# Altium schematic sheet 89C51最小系统+心形LED.SchDoc
size A4
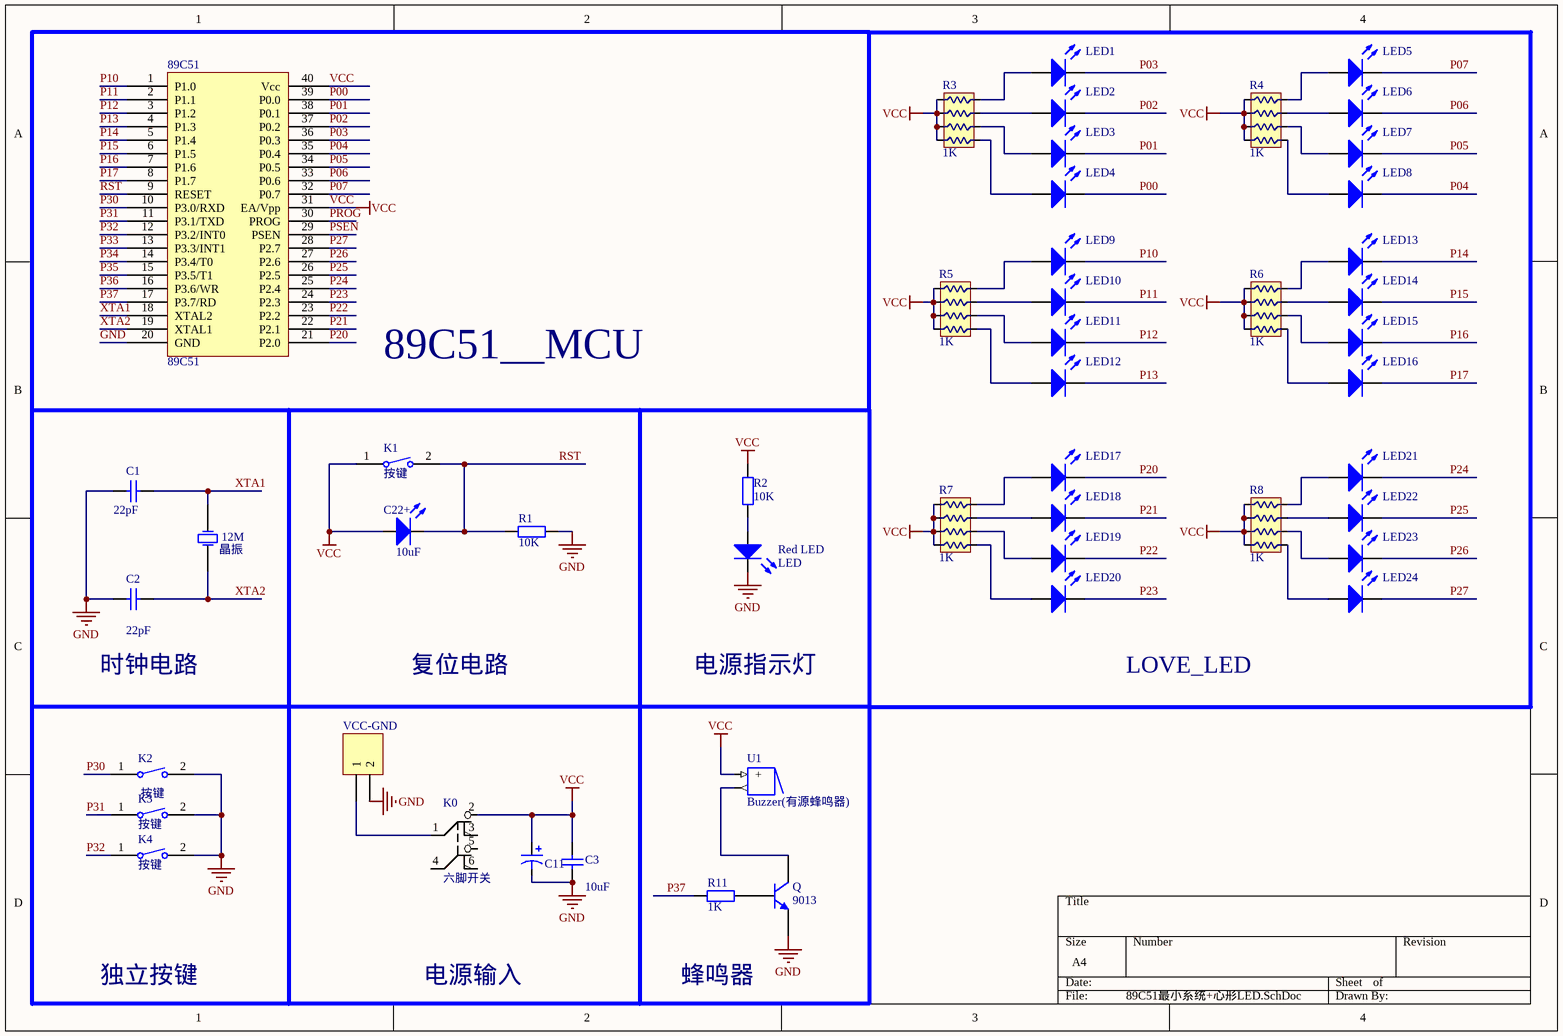
[diagram p0: 89C51最小系统+心形LED.SchDoc]

## Parts
12M  晶振  [晶振]
89C51  89C51  [89C51]
C1  value 22pF  [0805]
C2  value 22pF  [0805]
C3  value 10uF  [0805]
C11  100UF/470UF(封装慎选)  [ED6.3]  (value not drawn)
C22+  10uF  [LED(0805)]
K0  六脚开关  [按钮开关]
K1  按键  [按键]
K2  按键  [按键]
K3  按键  [按键]
K4  按键  [按键]
LED1  (no value)  [LED直插]
LED2  (no value)  [LED直插]
LED3  (no value)  [LED直插]
LED4  (no value)  [LED直插]
LED5  (no value)  [LED直插]
LED6  (no value)  [LED直插]
LED7  (no value)  [LED直插]
LED8  (no value)  [LED直插]
LED9  (no value)  [LED直插]
LED10  (no value)  [LED直插]
LED11  (no value)  [LED直插]
LED12  (no value)  [LED直插]
LED13  (no value)  [LED直插]
LED14  (no value)  [LED直插]
LED15  (no value)  [LED直插]
LED16  (no value)  [LED直插]
LED17  (no value)  [LED直插]
LED18  (no value)  [LED直插]
LED19  (no value)  [LED直插]
LED20  (no value)  [LED直插]
LED21  (no value)  [LED直插]
LED22  (no value)  [LED直插]
LED23  (no value)  [LED直插]
LED24  (no value)  [LED直插]
Q  9013  [TO-226-AA]
R1  10K  [0805]
R2  10K  [0805]
R3  1K  [排阻（4位）]
R4  1K  [排阻（4位）]
R5  1K  [排阻（4位）]
R6  1K  [排阻（4位）]
R7  1K  [排阻（4位）]
R8  1K  [排阻（4位）]
R11  1K  [0805]
Red_LED  LED  [LED(0805)]
U1  Buzzer(有源蜂鸣器)  [Buzzer]
VCC-GND  (no value)  [HDR1X2]

## Nets
GND: 89C51.20(GND) C1.1 C2.1 C3.1 C11.2 K2.2 K3.2 K4.2 Q.3(E) R1.2 Red_LED.2(K) VCC-GND.2
VCC: 89C51.31(EA/Vpp) 89C51.40(Vcc) C3.2 C11.1 C22+.1(A) K0.2 K1.1 R2.2 R3.1 R3.3 R3.5 R3.7 R4.1 R4.3 R4.5 R4.7 R5.1 R5.3 R5.5 R5.7 R6.1 R6.3 R6.5 R6.7 R7.1 R7.3 R7.5 R7.7 R8.1 R8.3 R8.5 R8.7 U1.1(+)
P00: 89C51.39(P0.0) LED4.2(K)
P01: 89C51.38(P0.1) LED3.2(K)
P02: 89C51.37(P0.2) LED2.2(K)
P03: 89C51.36(P0.3) LED1.2(K)
P04: 89C51.35(P0.4) LED8.2(K)
P05: 89C51.34(P0.5) LED7.2(K)
P06: 89C51.33(P0.6) LED6.2(K)
P07: 89C51.32(P0.7) LED5.2(K)
P10: 89C51.1(P1.0) LED9.2(K)
P11: 89C51.2(P1.1) LED10.2(K)
P12: 89C51.3(P1.2) LED11.2(K)
P13: 89C51.4(P1.3) LED12.2(K)
P14: 89C51.5(P1.4) LED13.2(K)
P15: 89C51.6(P1.5) LED14.2(K)
P16: 89C51.7(P1.6) LED15.2(K)
P17: 89C51.8(P1.7) LED16.2(K)
P20: 89C51.21(P2.0) LED17.2(K)
P21: 89C51.22(P2.1) LED18.2(K)
P22: 89C51.23(P2.2) LED19.2(K)
P23: 89C51.24(P2.3) LED20.2(K)
P24: 89C51.25(P2.4) LED21.2(K)
P25: 89C51.26(P2.5) LED22.2(K)
P26: 89C51.27(P2.6) LED23.2(K)
P27: 89C51.28(P2.7) LED24.2(K)
P30: 89C51.10(P3.0/RXD) K2.1
P31: 89C51.11(P3.1/TXD) K3.1
P32: 89C51.12(P3.2/INT0) K4.1
P33: 89C51.13(P3.3/INT1)
P34: 89C51.14(P3.4/T0)
P35: 89C51.15(P3.5/T1)
P36: 89C51.16(P3.6/WR)
P37: 89C51.17(P3.7/RD) R11.2
PROG: 89C51.30(PROG)
PSEN: 89C51.29(PSEN)
RST: 89C51.9(RESET) C22+.2(K) K1.2 R1.1
XTA1: 12M.2 89C51.18(XTAL2) C1.2
XTA2: 12M.1 89C51.19(XTAL1) C2.2
NetK0_1: K0.1 VCC-GND.1
NetLED1_1: LED1.1(A) R3.2
NetLED2_1: LED2.1(A) R3.4
NetLED3_1: LED3.1(A) R3.6
NetLED4_1: LED4.1(A) R3.8
NetLED5_1: LED5.1(A) R4.2
NetLED6_1: LED6.1(A) R4.4
NetLED7_1: LED7.1(A) R4.6
NetLED8_1: LED8.1(A) R4.8
NetLED9_1: LED9.1(A) R5.2
NetLED10_1: LED10.1(A) R5.4
NetLED11_1: LED11.1(A) R5.6
NetLED12_1: LED12.1(A) R5.8
NetLED13_1: LED13.1(A) R6.2
NetLED14_1: LED14.1(A) R6.4
NetLED15_1: LED15.1(A) R6.6
NetLED16_1: LED16.1(A) R6.8
NetLED17_1: LED17.1(A) R7.2
NetLED18_1: LED18.1(A) R7.4
NetLED19_1: LED19.1(A) R7.6
NetLED20_1: LED20.1(A) R7.8
NetLED21_1: LED21.1(A) R8.2
NetLED22_1: LED22.1(A) R8.4
NetLED23_1: LED23.1(A) R8.6
NetLED24_1: LED24.1(A) R8.8
NetQ_1: Q.1(C) U1.2
NetQ_2: Q.2(B) R11.1
NetR2_1: R2.1 Red_LED.1(A)

Not connected (* = marked no-connect by the designer): K0 3 4 5 6

## Notes on the sheet
- 89C51__MCU
- 时钟电路
- 复位电路
- 电源指示灯
- LOVE_LED
- 独立按键
- 电源输入
- 蜂鸣器

## Library data of the parts
89C51 = Component_1
C1-C3 = Cap: 无极电容; MADE IN: JMU 智能车制造中心
C11 = 固态贴片电容: ED8:470UF  ED6.3:100UF; MADE IN: JMU 智能车制造中心
C22+ Red_LED = LED: 发光二极管; MADE IN: JMU 智能车制造中心
K0 = 六脚开关: 按钮开关; MADE IN: JMU 智能车制造中心
LED1-LED24 = LED
Q = NPN: NPN Bipolar Transistor; Published: 8-Jun-2000; LatestRevisionDate: 17-Jul-2002; LatestRevisionNote: Re-released for DXP Platform.; PackageReference: TO-226-AA; Publisher: Altium Limited; PackageDescription: TO, Flat Index; 3 In-Line, Axial Leads; Body Dia. 4.8mm; Leads 0.55 x 0.51 mm (max); Code_JEDEC: TO-226-AA
R1 R2 = Res: 通用电阻; MADE IN: JMU 智能车制造中心; Value: 10K
R3-R8 = 排阻（4位）: MADE IN: JMU 智能车制造中心
R11 = Res: 通用电阻; Value: 10K; MADE IN: JMU 智能车制造中心
U1 = Buzzer(有源蜂鸣器): MADE IN: JMU 智能车制造中心
VCC-GND = Header 2: Header, 2-Pin; LatestRevisionDate: 17-Jul-2002; LatestRevisionNote: Re-released for DXP Platform.; Publisher: Altium Limited